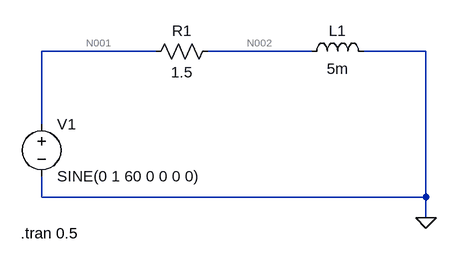
[diagram p0: schematic rl-seriese.asc]
rl-seriese.asc, the LTspice schematic file:
Version 4.1
SHEET 1 880 680
WIRE 80 16 -96 16
WIRE 320 16 160 16
WIRE 496 16 400 16
WIRE -96 128 -96 16
WIRE -96 240 -96 208
WIRE 496 240 496 16
WIRE 496 240 -96 240
WIRE 496 272 496 240
FLAG 496 272 0
SYMBOL res 176 0 R90
WINDOW 0 0 56 VBottom 2
WINDOW 3 32 56 VTop 2
SYMATTR InstName R1
SYMATTR Value 1.5
SYMBOL ind 304 32 R270
WINDOW 0 32 56 VTop 2
WINDOW 3 5 56 VBottom 2
SYMATTR InstName L1
SYMATTR Value 5m
SYMBOL voltage -96 112 R0
WINDOW 123 0 0 Left 0
WINDOW 39 0 0 Left 0
SYMATTR InstName V1
SYMATTR Value SINE(0 1 60 0 0 0 0)
TEXT -128 296 Left 2 !.tran 0.5

The netlist it stands for:
* rl-seriese.asc
R1 N002 N001 1.5
L1 N002 0 5m
V1 N001 0 SINE(0 1 60 0 0 0 0)
.tran 0.5
.backanno
.end

* Results of the author's LTspice run, read from the files saved beside the schematic
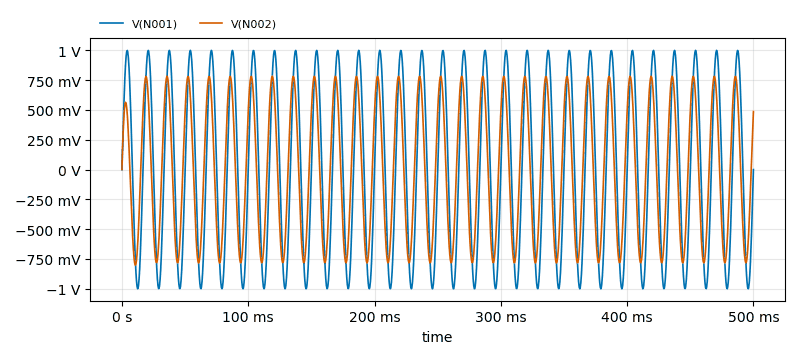
[diagram p1: Transient Analysis of rl-seriese.asc, plotted from the saved traces]
* Transient Analysis, 1 run:
*   V(N001): min -1 V, max 1 V, average 142.6 nV, rms 707.2 mV, last 0 V
*   V(N002): min -800.4 mV, max 783 mV, average -3.242 mV, rms 551.6 mV, last 486.6 mV